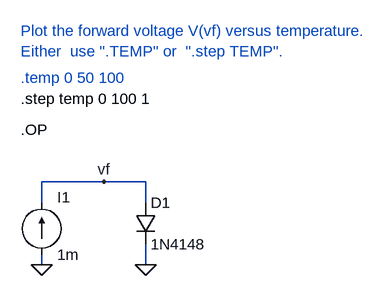
[diagram p0: schematic temperature_stepping1.asc]
temperature_stepping1.asc, the LTspice schematic file:
Version 4
SHEET 1 880 680
WIRE 80 160 -16 160
WIRE 144 160 80 160
WIRE -16 192 -16 160
WIRE 144 192 144 160
WIRE -16 288 -16 272
WIRE 144 288 144 256
FLAG -16 288 0
FLAG 144 288 0
FLAG 80 160 vf
SYMBOL diode 128 192 R0
SYMATTR InstName D1
SYMATTR Value 1N4148
SYMBOL current -16 272 M180
WINDOW 0 24 88 Left 0
WINDOW 3 24 0 Left 0
SYMATTR InstName I1
SYMATTR Value 1m
TEXT -48 80 Left 0 !.OP
TEXT -48 0 Left 0 ;.temp 0 50 100
TEXT -48 32 Left 0 !.step temp 0 100 1
TEXT -48 -72 Left 0 ;Plot the forward voltage V(vf) versus temperature.\nEither  use ".TEMP" or  ".step TEMP".

The netlist it stands for:
* temperature_stepping1.asc
D1 vf 0 1N4148
I1 0 vf 1m
.model D D
.lib standard.dio
.OP
* .temp 0 50 100
.step temp 0 100 1
* Plot the forward voltage V(vf) versus temperature.
* Either  use ".TEMP" or  ".step TEMP".
.backanno
.end